# Altium project analog_osc.PrjPCB
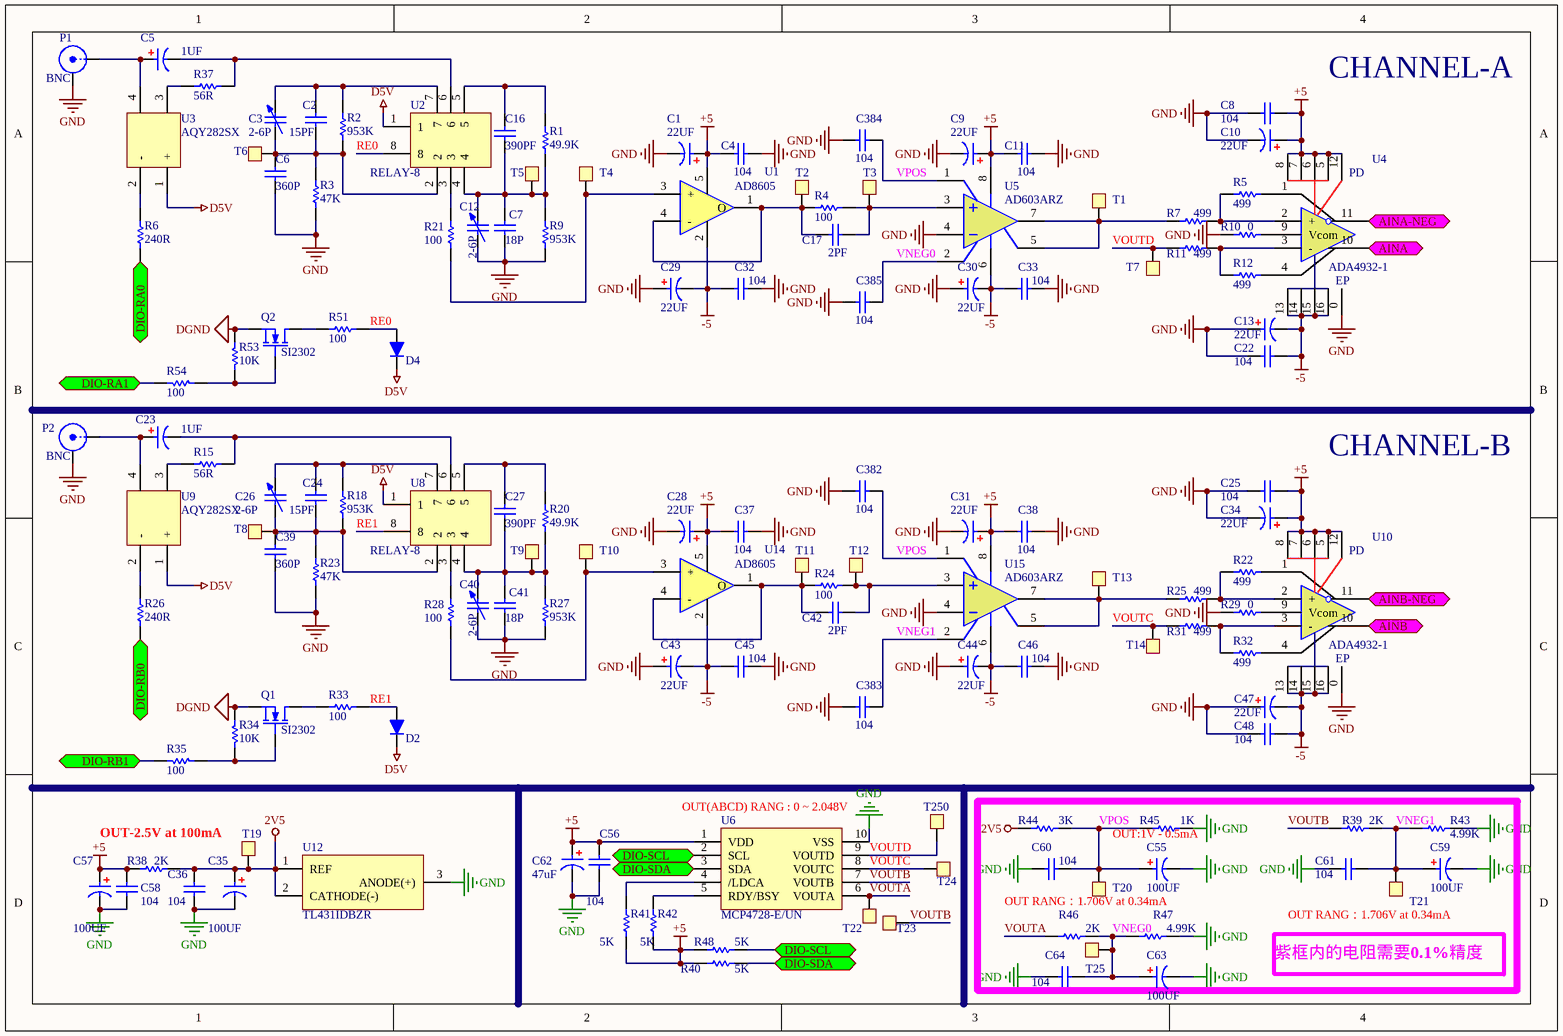
[diagram p0: analog_osc.SchDoc]
3 sheets, 292 parts. Net scope: flat (ports and power ports of the same name join across sheets).
Board files: analog_osc.PcbDoc, analog_edit.PcbDoc
Sheets:
  analog_osc.SchDoc
  digtal.SchDoc
  adc.SchDoc

## Sheet analog_osc.SchDoc
size A4

### Parts
C1  22UF  [0603C]
C2  15PF  [0603C]
C3  value 2-6P  [V-CAP]  (hidden comment: V_CAP)
C4  C104  [0402]  (value not drawn)
C5  1UF  [1812]
C6  360P  [0603C]
C7  18P  [0603C]
C8  C104  [0402]  (value not drawn)
C9  22UF  [0603C]
C10  22UF  [0603C]
C11  C104  [0402]  (value not drawn)
C12  value 2-6P  [V-CAP]  (hidden comment: V_CAP)
C13  22UF  [0603C]
C16  390PF  [0603C]
C17  2PF  [0603C]
C22  C104  [0402]  (value not drawn)
C23  1UF  [1812]
C24  15PF  [0603C]
C25  C104  [0402]  (value not drawn)
C26  value 2-6P  [V-CAP]  (hidden comment: V_CAP)
C27  390PF  [0603C]
C28  22UF  [0603C]
C29  22UF  [0603C]
C30  22UF  [0603C]
C31  22UF  [0603C]
C32  C104  [0402]  (value not drawn)
C33  C104  [0402]  (value not drawn)
C34  22UF  [0603C]
C35  100UF  [CAP-T-3630]
C36  C0.1uF  [0402]  (value not drawn)
C37  C104  [0402]  (value not drawn)
C38  C104  [0402]  (value not drawn)
C39  360P  [0603C]
C40  value 2-6P  [V-CAP]  (hidden comment: V_CAP)
C41  18P  [0603C]
C42  2PF  [0603C]
C43  22UF  [0603C]
C44  22UF  [0603C]
C45  C104  [0402]  (value not drawn)
C46  C104  [0402]  (value not drawn)
C47  22UF  [0603C]
C48  C104  [0402]  (value not drawn)
C55  100UF  [CAP-T-3630]
C56  C0.1uF  [0402]  (value not drawn)
C57  100UF  [CAP-T-3630]
C58  C0.1uF  [0402]  (value not drawn)
C59  100UF  [CAP-T-3630]
C60  C0.1uF  [0402]  (value not drawn)
C61  C0.1uF  [0402]  (value not drawn)
C62  47uF  [1206]
C63  100UF  [CAP-T-3630]
C64  C0.1uF  [0402]  (value not drawn)
C382  C104  [0402]  (value not drawn)
C383  C104  [0402]  (value not drawn)
C384  C104  [0402]  (value not drawn)
C385  C104  [0402]  (value not drawn)
D2  BAT54WS  [LC-SOD-323F]  (value not drawn)
D4  BAT54WS  [LC-SOD-323F]  (value not drawn)
P1  BNC  [BNC-OSC]
P2  BNC  [BNC-OSC]
Q1  SI2302  [SOT-23-3]
Q2  SI2302  [SOT-23-3]
R1  49.9K  [0603R]
R2  953K  [0603R]
R3  47K  [0603R]
R4  100  [0603R]
R5  499  [0402]
R6  240R  [0603R]
R7  499  [0402]
R9  953K  [0603R]
R10  0  [0603R]
R11  499  [0402]
R12  499  [0402]
R15  56R  [0603R]
R18  953K  [0603R]
R20  49.9K  [0603R]
R21  R100R  [0603R]  (value not drawn)
R22  499  [0402]
R23  47K  [0603R]
R24  100  [0603R]
R25  499  [0402]
R26  240R  [0603R]
R27  953K  [0603R]
R28  R100R  [0603R]  (value not drawn)
R29  0  [0603R]
R31  499  [0402]
R32  499  [0402]
R33  R100R  [0402]  (value not drawn)
R34  R10K  [0402]  (value not drawn)
R35  R100R  [0402]  (value not drawn)
R37  56R  [0603R]
R38  R2K  [0402]  (value not drawn)
R39  R2K  [0402]  (value not drawn)
R40  R5K  [0402]  (value not drawn)
R41  R5K  [0402]  (value not drawn)
R42  R5K  [0402]  (value not drawn)
R43  R4.99K  [0402]  (value not drawn)
R44  R3K  [0402]  (value not drawn)
R45  R1K  [0402]  (value not drawn)
R46  R2K  [0402]  (value not drawn)
R47  R4.99K  [0402]  (value not drawn)
R48  R5K  [0402]  (value not drawn)
R51  R100R  [0402]  (value not drawn)
R53  R10K  [0402]  (value not drawn)
R54  R100R  [0402]  (value not drawn)
T1  TP  [TEST_POINT]  (value not drawn)
T2  TP  [TEST_POINT]  (value not drawn)
T3  TP  [TEST_POINT]  (value not drawn)
T4  TP  [TEST_POINT]  (value not drawn)
T5  TP  [TEST_POINT]  (value not drawn)
T6  TP  [TEST_POINT]  (value not drawn)
T7  TP  [TEST_POINT]  (value not drawn)
T8  TP  [TEST_POINT]  (value not drawn)
T9  TP  [TEST_POINT]  (value not drawn)
T10  TP  [TEST_POINT]  (value not drawn)
T11  TP  [TEST_POINT]  (value not drawn)
T12  TP  [TEST_POINT]  (value not drawn)
T13  TP  [TEST_POINT]  (value not drawn)
T14  TP  [TEST_POINT]  (value not drawn)
T19  TP  [TEST_POINT]  (value not drawn)
T20  TP  [TEST_POINT]  (value not drawn)
T21  TP  [TEST_POINT]  (value not drawn)
T22  TP  [TEST_POINT]  (value not drawn)
T23  TP  [TEST_POINT]  (value not drawn)
T24  TP  [TEST_POINT]  (value not drawn)
T25  TP  [TEST_POINT]  (value not drawn)
T250  TP  [TEST_POINT]  (value not drawn)
U1  AD8605  [SOT23-5]
U2  RELAY-8  [RELAY-GS6-8]
U3  AQY282SX  [SOP4]
U4  ADA4932-1  [LFCSP-16]
U5  AD603ARZ  [SOP-8]
U6  MCP4728-E/UN  [MSOP10]
U8  RELAY-8  [RELAY-GS6-8]
U9  AQY282SX  [SOP4]
U10  ADA4932-1  [LFCSP-16]
U12  TL431IDBZR  [SOT-23-3]
U14  AD8605  [SOT23-5]
U15  AD603ARZ  [SOP-8]

### Blocks framed on the sheet
紫框内的电阻需要0.1%精度: C55 C59-C61 C63 C64 R39 R43-R47 T20 T21 T25

### Ports
AINA, AINA-NEG, AINB, AINB-NEG, DIO-RA0, DIO-RA1, DIO-RB0, DIO-RB1, DIO-SCL, DIO-SDA

### Nets
2V5: C35.1 C36.1 R38.2 R44.2 T19.1(R) U12.1(REF) U12.2(CATHODE(-))
+5: C1.1 C4.1 C8.2 C9.1 C10.1 C11.1 C25.2 C28.1 C31.1 C34.1 C37.1 C38.1 C56.1 C57.1 C58.1 C62.1 R38.1 R40.1 R41.1 R42.1 R48.2 U1.5(V+) U4.5 U4.6 U4.7 U4.8 U4.12(PD) U5.8(V+) U6.1(VDD) U10.5 U10.6 U10.7 U10.8 U10.12(PD) U14.5(V+) U15.8(V+)
-5: C13.2 C22.2 C29.2 C30.2 C32.1 C33.1 C43.2 C44.2 C45.1 C46.1 C47.2 C48.2 U1.2(V-) U4.13 U4.14 U4.15 U4.16 U5.6(V-) U10.13 U10.14 U10.15 U10.16 U14.2(V-) U15.6(V-)
D5V: D2.2(K) D4.2(K) U2.1 U3.1(+) U8.1 U9.1(+)
DGND: C1.2 C4.2 C6.2 C7.2 C8.1 C9.2 C10.2 C11.2 C12.1 C13.1 C22.1 C25.1 C28.2 C29.1 C30.1 C31.2 C32.2 C33.2 C34.2 C35.2 C36.2 C37.2 C38.2 C39.2 C40.1 C41.2 C43.1 C44.1 C45.2 C46.2 C47.1 C48.1 C55.2 C56.2 C57.2 C58.2 C59.2 C60.1 C61.1 C62.2 C63.2 C64.1 C382.1 C383.1 C384.1 C385.1 P1.2(Y) P2.2(Y) Q1.2(S) Q2.2(S) R3.2 R9.2 R10.1 R23.2 R27.2 R29.1 R34.2 R43.1 R45.1 R47.1 R53.2 U4.0(EP) U5.4(IN-) U6.10(VSS) U10.0(EP) U12.3(ANODE(+)) U15.4(IN-)  [also labelled GND]
RE0: D4.1(A) R51.2 U2.8
RE1: D2.1(A) R33.2 U8.8
VNEG0: C63.1 C64.2 C385.2 R46.1 R47.2 T25.1(R) U5.2(G-)
VNEG1: C59.1 C61.2 C383.2 R39.1 R43.2 T21.1(R) U15.2(G-)
VOUTA: R46.2 T22.1(R) U6.6(VOUTA)
VOUTB: R39.2 T23.1(R) U6.7(VOUTB)
VOUTC: R31.1 T14.1(R) T24.1(R) U6.8(VOUTC)
VOUTD: R11.1 T7.1(R) T250.1(R) U6.9(VOUTD)
VPOS: C55.1 C60.2 C382.2 C384.2 R44.1 R45.2 T20.1(R) U5.1(G+) U15.1(G+)
NetC2_1: C2.1 C3.2 R2.1 U2.7
NetC2_2: C2.2 C3.1 C6.1 R2.2 R3.1 T6.1(R) U2.2
NetC5_1: C5.1 P1.1(X) U3.4
NetC5_2: C5.2 R37.2 U2.6
NetC7_1: C7.1 C12.2 C16.2 R1.2 R9.1 T5.1(R) U2.4
NetC16_1: C16.1 R1.1 U2.5
NetC17_1: C17.1 R4.1 T2.1(R) U1.1(O) U1.4(-)
NetC17_2: C17.2 R4.2 T3.1(R) U5.3(IN+)
NetC23_1: C23.1 P2.1(X) U9.4
NetC23_2: C23.2 R15.2 U8.6
NetC24_1: C24.1 C26.2 R18.1 U8.7
NetC24_2: C24.2 C26.1 C39.1 R18.2 R23.1 T8.1(R) U8.2
NetC27_1: C27.1 R20.1 U8.5
NetC27_2: C27.2 C40.2 C41.1 R20.2 R27.1 T9.1(R) U8.4
NetC42_1: C42.1 R24.1 T11.1(R) U14.1(O) U14.4(-)
NetC42_2: C42.2 R24.2 T12.1(R) U15.3(IN+)
NetP3_20: R35.2 ; port DIO-RB1
NetP3_21: R26.1 ; port DIO-RB0
NetP3_25: R40.2 U6.3(SDA) ; port DIO-SDA
NetP3_26: R48.1 U6.2(SCL) ; port DIO-SCL
NetP3_38: R6.1 ; port DIO-RA0
NetP3_39: R54.2 ; port DIO-RA1
NetQ1_1: Q1.1(G) R34.1 R35.1
NetQ1_3: Q1.3(D) R33.1
NetQ2_1: Q2.1(G) R53.1 R54.1
NetQ2_3: Q2.3(D) R51.1
NetR5_1: R5.1 R7.2 U4.2(+)
NetR5_2: R5.2 U4.1
NetR6_2: R6.2 U3.2(-)
NetR7_1: R7.1 T1.1(R) U5.5(FB) U5.7(OUT)
NetR10_2: R10.2 U4.9(Vcom)
NetR11_2: R11.2 R12.1 U4.3(-)
NetR12_2: R12.2 U4.4
NetR15_1: R15.1 U9.3
NetR21_1: R21.1 U2.3
NetR21_2: R21.2 T4.1(R) U1.3(+)
NetR22_1: R22.1 R25.2 U10.2(+)
NetR22_2: R22.2 U10.1
NetR25_1: R25.1 T13.1(R) U15.5(FB) U15.7(OUT)
NetR26_2: R26.2 U9.2(-)
NetR28_1: R28.1 U8.3
NetR28_2: R28.2 T10.1(R) U14.3(+)
NetR29_2: R29.2 U10.9(Vcom)
NetR31_2: R31.2 R32.1 U10.3(-)
NetR32_2: R32.2 U10.4
NetR37_1: R37.1 U3.3
NetR41_2: R41.2 U6.4(/LDCA)
NetR42_2: R42.2 U6.5(RDY/BSY)
NetR52_1: U10.10 ; port AINB
NetR60_1: U4.11 ; port AINA-NEG
NetR69_2: U4.10 ; port AINA
NetR72_2: U10.11 ; port AINB-NEG

### Notes on the sheet
- CHANNEL-A
- CHANNEL-B
- OUT-2.5V at 100mA
- (near U6) OUT(ABCD) RANG : 0 ~ 2.048V
- (near R45) OUT:1V - 0.5mA
- (near T20) OUT RANG：1.706V at 0.34mA
- OUT RANG：1.706V at 0.34mA
- (in symbol C0.1uF) 104
- (in symbol R10K) 2K; 5K; 3K; 1K; 4.99K; 10K
- (in symbol R100R) 100

### Library data of the parts
C1 C5 C9 C10 C13 C23 C28-C31 C34 C35 C43 C44 C47 C55 C57 C59 C62 C63 = C10uF: 贴片电容
C2 C4 C6-C8 C11 C16 C17 C22 C24 C25 C27 C32 C33 C37-C39 C41 C42 C45 C46 C48 C382-C385 = C0.1uF: 贴片电容
C3 C12 C26 C40 = Cap Var: Variable or Adjustable Capacitor; Published: 24-Mar-1999; LatestRevisionDate: 29-May-2009; LatestRevisionNote: IPC-7351 Footprint Added.; PackageReference: C1210; Publisher: Altium Limited; PackageDescription: Chip Capacitor 1210 Case Size; Code_JEITA: 1210; Code_IPC: CAPC3225
D2 D4 = Diode
P1 P2 = BNC: BNC Elbow Connector; LatestRevisionDate: 17-Jul-2002; LatestRevisionNote: Re-released for DXP Platform.; Publisher: Altium Limited
Q1 Q2 = MOSFET-N
R1-R7 R9-R12 R15 R18 R20 R22-R27 R29 R31 R32 R37 = R1M
R38-R48 = R10K

## Sheet digtal.SchDoc
size A4
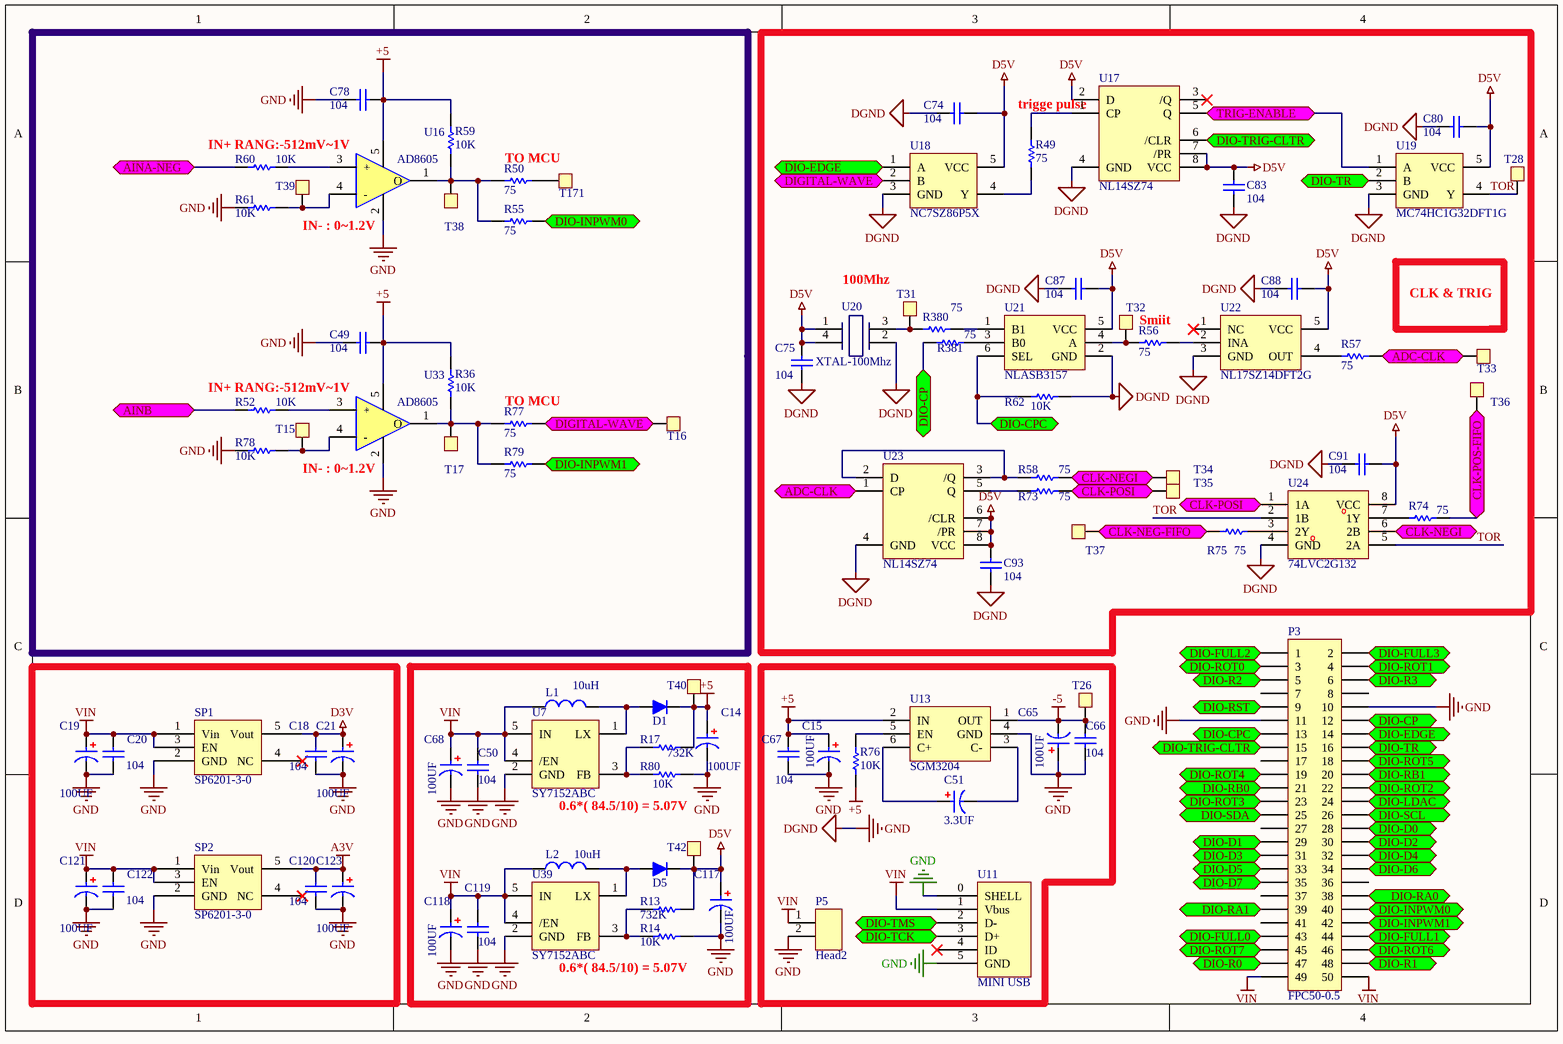
[diagram p1: digtal.SchDoc]

### Parts
C14  100UF  [CAP-T-3630]
C15  100UF  [CAP-T-3630]
C18  C104  [0402]  (value not drawn)
C19  100UF  [CAP-T-3630]
C20  C104  [0402]  (value not drawn)
C21  100UF  [CAP-T-3630]
C49  C104  [0402]  (value not drawn)
C50  C104  [0402]  (value not drawn)
C51  3.3UF  [0603C]
C65  100UF  [CAP-T-3630]
C66  C104  [0402]  (value not drawn)
C67  C104  [0402]  (value not drawn)
C68  100UF  [CAP-T-3630]
C74  C104  [0402]  (value not drawn)
C75  C104  [0402]  (value not drawn)
C78  C104  [0402]  (value not drawn)
C80  C104  [0402]  (value not drawn)
C83  C104  [0402]  (value not drawn)
C87  C104  [0402]  (value not drawn)
C88  C104  [0402]  (value not drawn)
C91  C104  [0402]  (value not drawn)
C93  C104  [0402]  (value not drawn)
C117  100UF  [CAP-T-3630]
C118  100UF  [CAP-T-3630]
C119  C104  [0402]  (value not drawn)
C120  C104  [0402]  (value not drawn)
C121  100UF  [CAP-T-3630]
C122  C104  [0402]  (value not drawn)
C123  100UF  [CAP-T-3630]
D1  1N5918WS  [SOD23-322F]  (value not drawn)
D5  1N5918WS  [SOD23-322F]  (value not drawn)
L1  10uH  [0805]
L2  10uH  [0805]
P3  FPC50-0.5  [FPC50-0.5]
P5  Head2  [HEAD2]
R13  732K  [0402]
R14  10K  [0402]
R17  732K  [0402]
R36  10K  [0402]
R49  75  [0402]
R50  75  [0402]
R52  10K  [0402]
R55  75  [0402]
R56  75  [0402]
R57  75  [0402]
R58  75  [0402]
R59  10K  [0402]
R60  10K  [0402]
R61  10K  [0402]
R62  10K  [0402]
R73  75  [0402]
R74  75  [0402]
R75  75  [0402]
R76  R10K  [0402]  (value not drawn)
R77  75  [0402]
R78  10K  [0402]
R79  75  [0402]
R80  10K  [0402]
R380  75  [0402]
R381  75  [0402]
SP1  SP6201-3-0  [SOT23-5]
SP2  SP6201-3-0  [SOT23-5]
T15  TP  [TEST_POINT]  (value not drawn)
T16  TP  [TEST_POINT]  (value not drawn)
T17  TP  [TEST_POINT]  (value not drawn)
T26  TP  [TEST_POINT]  (value not drawn)
T28  TP  [TEST_POINT]  (value not drawn)
T31  TP  [TEST_POINT]  (value not drawn)
T32  TP  [TEST_POINT]  (value not drawn)
T33  TP  [TEST_POINT]  (value not drawn)
T34  TP  [TEST_POINT]  (value not drawn)
T35  TP  [TEST_POINT]  (value not drawn)
T36  TP  [TEST_POINT]  (value not drawn)
T37  TP  [TEST_POINT]  (value not drawn)
T38  TP  [TEST_POINT]  (value not drawn)
T39  TP  [TEST_POINT]  (value not drawn)
T40  TP  [TEST_POINT]  (value not drawn)
T42  TP  [TEST_POINT]  (value not drawn)
T171  TP  [TEST_POINT]  (value not drawn)
U7  SY7152ABC  [SOT23-6]
U11  MINI USB  [Micro_USB_t]
U13  SGM3204  [SOT23-6]
U16  AD8605  [SOT23-5]
U17  NL14SZ74  [VFSOP-8]
U18  NC7SZ86P5X  [sc70-5]
U19  MC74HC1G32DFT1G  [SC70-5]
U20  XTAL-100Mhz  [7050]
U21  NLASB3157  [SC-88]
U22  NL17SZ14DFT2G  [SC70-5]
U23  NL14SZ74  [VFSOP-8]
U24  74LVC2G132  [VFSOP-8]
U33  AD8605  [SOT23-5]
U39  SY7152ABC  [SOT23-6]

### Ports
ADC-CLK, AINA-NEG, AINB, CLK-NEG-FIFO, CLK-NEGI, CLK-POS-FIFO, CLK-POSI, DIGITAL-WAVE, DIO-CP, DIO-CPC, DIO-D0, DIO-D1, DIO-D2, DIO-D3, DIO-D4, DIO-D5, DIO-D6, DIO-D7, DIO-EDGE, DIO-FULL0, DIO-FULL1, DIO-FULL2, DIO-FULL3, DIO-INPWM0, DIO-INPWM1, DIO-LDAC, DIO-R0, DIO-R1, DIO-R2, DIO-R3, DIO-RA0, DIO-RA1, DIO-RB0, DIO-RB1, DIO-ROT0, DIO-ROT1, DIO-ROT2, DIO-ROT3, DIO-ROT4, DIO-ROT5, DIO-ROT6, DIO-ROT7, DIO-RST, DIO-SCL, DIO-SDA, DIO-TCK, DIO-TMS, DIO-TR, DIO-TRIG-CLTR, TRIG-ENABLE

### Nets
+5: C14.1 C15.1 C49.1 C67.1 C78.1 D1.2(K) R17.2 R36.1 R59.1 R76.1 T40.1(R) U13.2(IN) U16.5(V+) U33.5(V+)
-5: C65.2 C66.1 T26.1(R) U13.1(OUT)
A3V: C120.1 C123.1 SP2.5(Vout)
D3V: C18.1 C21.1 SP1.5(Vout)
D5V: C74.1 C75.1 C80.1 C83.1 C87.1 C88.1 C91.1 C93.1 C117.1 D5.2(K) R13.2 T42.1(R) U17.2(D) U17.7(/PR) U17.8(VCC) U18.5(VCC) U19.5(VCC) U20.1 U20.4 U21.5(VCC) U22.5(VCC) U23.6(/CLR) U23.7(/PR) U23.8(VCC) U24.8(VCC)
DGND: C14.2 C15.2 C18.2 C19.2 C20.2 C21.2 C49.2 C50.2 C65.1 C66.2 C67.2 C68.2 C74.2 C75.2 C78.2 C80.2 C83.2 C87.2 C88.2 C91.2 C93.2 C117.2 C118.2 C119.2 C120.2 C121.2 C122.2 C123.2 P3.10 P3.11 P5.2 R14.1 R61.1 R62.2 R78.1 R80.1 SP1.2(GND) SP2.2(GND) U7.2(GND) U11.0(SHELL) U11.5(GND) U13.4(GND) U16.2(V-) U17.4(GND) U18.3(GND) U19.3(GND) U20.2 U21.2(GND) U22.3(GND) U23.4(GND) U24.4(GND) U33.2(V-) U39.2(GND)  [also labelled GND]
VIN: C19.1 C20.1 C50.1 C68.1 C118.1 C119.1 C121.1 C122.1 L1.1 L2.1 P3.49 P3.50 P5.1 SP1.1(Vin) SP1.3(EN) SP2.1(Vin) SP2.3(EN) U7.4(/EN) U7.5(IN) U11.1(Vbus) U39.4(/EN) U39.5(IN)
DQA1: P3.28 ; port DIO-D0
DQA2: P3.29 ; port DIO-D1
DQA3: P3.30 ; port DIO-D2
DQA4: P3.31 ; port DIO-D3
DQA5: P3.35 ; port DIO-D7
DQA6: P3.34 ; port DIO-D6
DQA7: P3.33 ; port DIO-D5
DQA8: P3.32 ; port DIO-D4
TOR: T28.1(R) U19.4(Y) U24.2(1B) U24.5(2A)
NetC51_1: C51.1 U13.6(C+)
NetC51_2: C51.2 U13.3(C-)
NetD1_1: D1.1(A) L1.2 U7.1(LX)
NetD5_1: D5.1(A) L2.2 U39.1(LX)
NetP3_1: P3.1 ; port DIO-FULL2
NetP3_2: P3.2 ; port DIO-FULL3
NetP3_3: P3.3 ; port DIO-ROT0
NetP3_4: P3.4 ; port DIO-ROT1
NetP3_5: P3.5 ; port DIO-R2
NetP3_6: P3.6 ; port DIO-R3
NetP3_9: P3.9 ; port DIO-RST
NetP3_12: P3.12 R381.2 ; port DIO-CP
NetP3_13: P3.13 R62.1 U21.6(SEL) ; port DIO-CPC
NetP3_14: P3.14 U18.1(A) ; port DIO-EDGE
NetP3_15: P3.15 U17.6(/CLR) ; port DIO-TRIG-CLTR
NetP3_16: P3.16 U19.2(B) ; port DIO-TR
NetP3_18: P3.18 ; port DIO-ROT5
NetP3_19: P3.19 ; port DIO-ROT4
NetP3_20: P3.20 ; port DIO-RB1
NetP3_21: P3.21 ; port DIO-RB0
NetP3_22: P3.22 ; port DIO-ROT2
NetP3_23: P3.23 ; port DIO-ROT3
NetP3_24: P3.24 ; port DIO-LDAC
NetP3_25: P3.25 ; port DIO-SDA
NetP3_26: P3.26 ; port DIO-SCL
NetP3_38: P3.38 ; port DIO-RA0
NetP3_39: P3.39 ; port DIO-RA1
NetP3_40: P3.40 R55.2 ; port DIO-INPWM0
NetP3_42: P3.42 R79.2 ; port DIO-INPWM1
NetP3_43: P3.43 ; port DIO-FULL0
NetP3_44: P3.44 ; port DIO-FULL1
NetP3_45: P3.45 ; port DIO-ROT7
NetP3_46: P3.46 ; port DIO-ROT6
NetP3_47: P3.47 ; port DIO-R0
NetP3_48: P3.48 ; port DIO-R1
NetR13_1: R13.1 R14.2 U39.3(FB)
NetR17_1: R17.1 R80.2 U7.3(FB)
NetR36_2: R36.2 R77.1 R79.1 T17.1(R) U33.1(O)
NetR49_1: R49.1 U18.4(Y)
NetR49_2: R49.2 U17.1(CP)
NetR50_1: R50.1 R55.1 R59.2 T38.1(R) U16.1(O)
NetR50_2: R50.2 T171.1(R)
NetR52_1: R52.1 ; port AINB
NetR52_2: R52.2 U33.3(+)
NetR56_1: R56.1 U22.2(INA)
NetR56_2: R56.2 T32.1(R) U21.4(A)
NetR57_1: R57.1 T33.1(R) U23.1(CP) ; port ADC-CLK
NetR57_2: R57.2 U22.4(OUT)
NetR58_1: R58.1 T34.1(R) U24.6(2B) ; port CLK-NEGI
NetR58_2: R58.2 U23.2(D) U23.3(/Q)
NetR60_1: R60.1 ; port AINA-NEG
NetR60_2: R60.2 U16.3(+)
NetR61_2: R61.2 T39.1(R) U16.4(-)
NetR73_1: R73.1 T35.1(R) U24.1(1A) ; port CLK-POSI
NetR73_2: R73.2 U23.5(Q)
NetR74_1: R74.1 T36.1(R) ; port CLK-POS-FIFO
NetR74_2: R74.2 U24.7(1Y)
NetR75_1: R75.1 U24.3(2Y)
NetR75_2: R75.2 T37.1(R) ; port CLK-NEG-FIFO
NetR76_2: R76.2 U13.5(EN)
NetR77_2: R77.2 T16.1(R) U18.2(B) ; port DIGITAL-WAVE
NetR78_2: R78.2 T15.1(R) U33.4(-)
NetR380_1: R380.1 U21.1(B1)
NetR380_2: R380.2 T31.1(R) U20.3
NetR381_1: R381.1 U21.3(B0)
NetU11_2: U11.2(D-) ; port DIO-TMS
NetU11_3: U11.3(D+) ; port DIO-TCK
NetU17_5: U17.5(Q) U19.1(A) ; port TRIG-ENABLE

Not connected (* = marked no-connect by the designer): P3 7 8 17 27 36 37 41; SP1 4(NC)*; SP2 4(NC)*; U7 6; U11 4(ID)*; U17 3(/Q)*; U22 1(NC)*; U39 6

### Notes on the sheet
- (near U17) trigge pulse
- (near R60) IN+ RANG:-512mV~1V
- TO MCU
- IN- : 0~1.2V
- 100Mhz
- CLK & TRIG
- Smiit
- (near R52) IN+ RANG:-512mV~1V
- (near R77) TO MCU
- 0.6*( 84.5/10) = 5.07V
- (in symbol C0.1uF) 104
- (in symbol R10K) 10K

### Library data of the parts
C14 C15 C19 C21 C51 C65 C68 C117 C118 C121 C123 = C10uF: 贴片电容
C18 C20 C49 C50 C66 C67 C74 C75 C78 C80 C83 C87 C88 C91 C93 C119 C120 C122 = C0.1uF: 贴片电容
D1 D5 = Diode
L1 L2 = Inductor-100uH
P3 = Header 25X2: Header, 25-Pin, Dual row; LatestRevisionDate: 17-Jul-2002; LatestRevisionNote: Re-released for DXP Platform.; Publisher: Altium Limited
R13 R14 R17 R36 R49 R50 R52 R55-R62 R73-R75 R77-R80 R380 R381 = R1M
SP1 SP2 = SP6201
U24 = 74LVC2G132DCUR

## Sheet adc.SchDoc
size A4
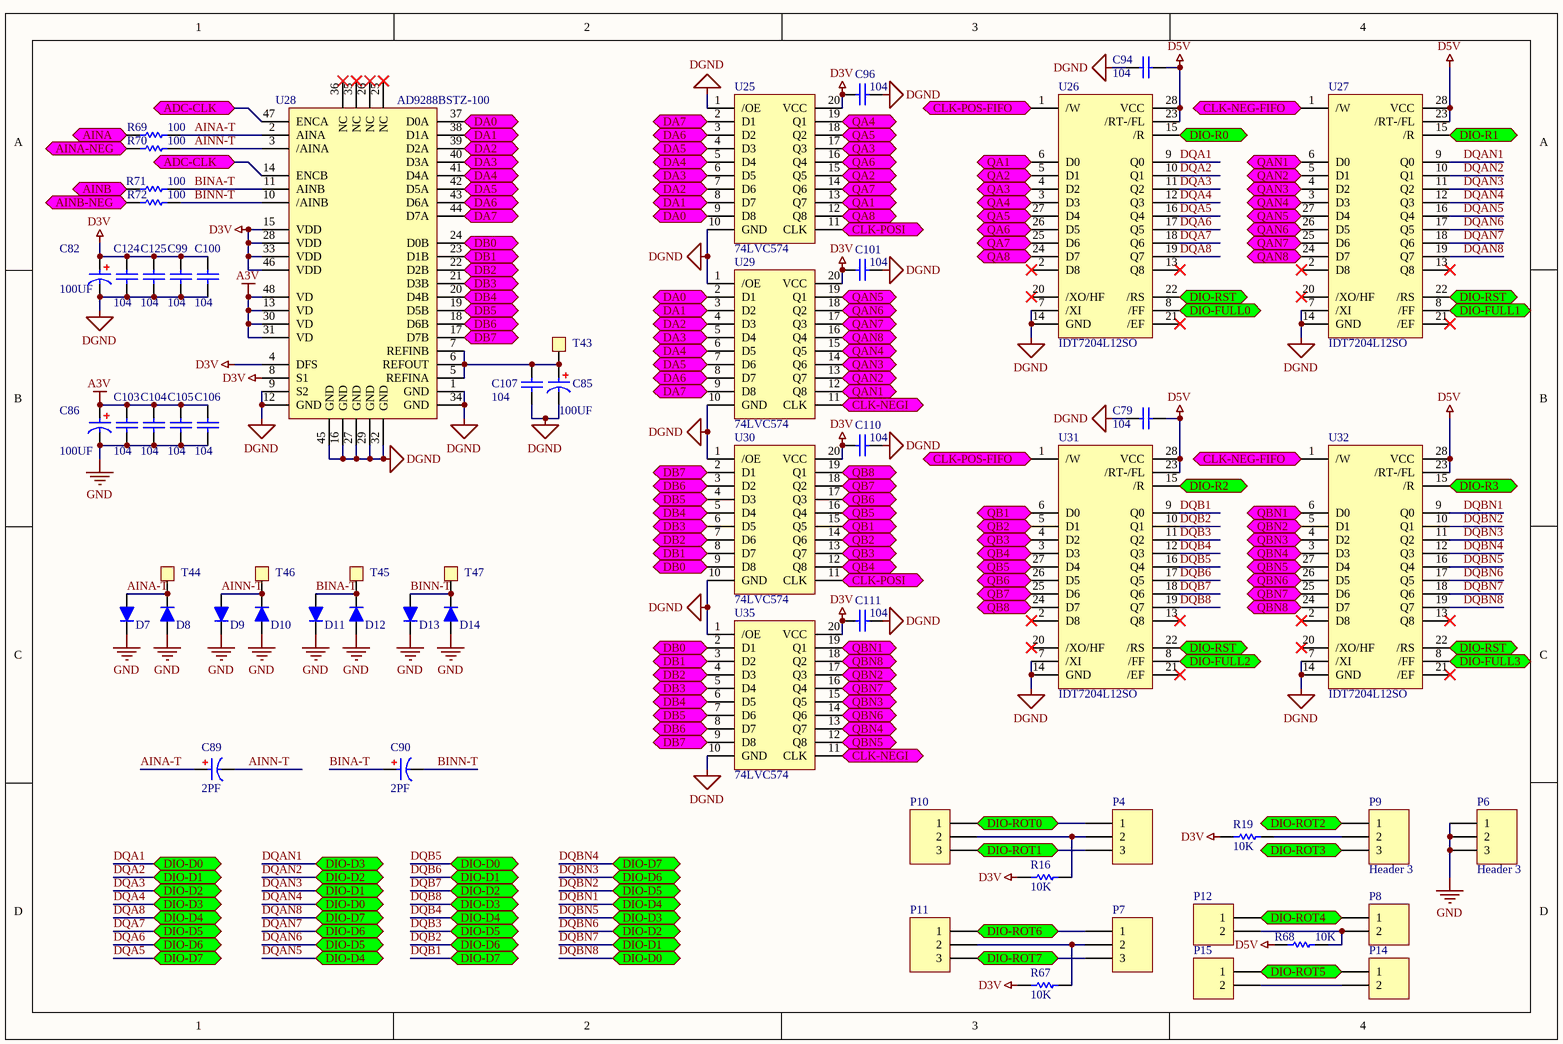
[diagram p2: adc.SchDoc]

### Parts
C79  C104  [0402]  (value not drawn)
C82  100UF  [CAP-T-3630]
C85  100UF  [CAP-T-3630]
C86  100UF  [CAP-T-3630]
C89  2PF  [0603C]
C90  2PF  [0603C]
C94  C104  [0402]  (value not drawn)
C96  C104  [0402]  (value not drawn)
C99  C104  [0402]  (value not drawn)
C100  C104  [0402]  (value not drawn)
C101  C104  [0402]  (value not drawn)
C103  C104  [0402]  (value not drawn)
C104  C104  [0402]  (value not drawn)
C105  C104  [0402]  (value not drawn)
C106  C104  [0402]  (value not drawn)
C107  C104  [0402]  (value not drawn)
C110  C104  [0402]  (value not drawn)
C111  C104  [0402]  (value not drawn)
C124  C104  [0402]  (value not drawn)
C125  C104  [0402]  (value not drawn)
D7  KDS4148U  [LC-SOD-323F]  (value not drawn)
D8  KDS4148U  [LC-SOD-323F]  (value not drawn)
D9  KDS4148U  [LC-SOD-323F]  (value not drawn)
D10  KDS4148U  [LC-SOD-323F]  (value not drawn)
D11  KDS4148U  [LC-SOD-323F]  (value not drawn)
D12  KDS4148U  [LC-SOD-323F]  (value not drawn)
D13  KDS4148U  [LC-SOD-323F]  (value not drawn)
D14  KDS4148U  [LC-SOD-323F]  (value not drawn)
P4  Header 3  [ROTA-3PIN]  (value not drawn)
P6  Header 3  [ROTA-3PIN]
P7  Header 3  [ROTA-3PIN]  (value not drawn)
P8  Header 2  [ROTA-2PIN]  (value not drawn)
P9  Header 3  [ROTA-3PIN]
P10  Header 3  [ROTA-3PIN]  (value not drawn)
P11  Header 3  [ROTA-3PIN]  (value not drawn)
P12  Header 2  [ROTA-2PIN]  (value not drawn)
P14  Header 2  [ROTA-2PIN]  (value not drawn)
P15  Header 2  [ROTA-2PIN]  (value not drawn)
R16  10K  [0402]
R19  10K  [0402]
R67  10K  [0402]
R68  10K  [0402]
R69  100  [0603R]
R70  100  [0603R]
R71  100  [0603R]
R72  100  [0603R]
T43  TP  [TEST_POINT]  (value not drawn)
T44  TP  [TEST_POINT]  (value not drawn)
T45  TP  [TEST_POINT]  (value not drawn)
T46  TP  [TEST_POINT]  (value not drawn)
T47  TP  [TEST_POINT]  (value not drawn)
U25  74LVC574  [TSSOP20]
U26  IDT7204L12SO  [SO28-3]
U27  IDT7204L12SO  [SO28-3]
U28  AD9288BSTZ-100  [LQFP48]
U29  74LVC574  [TSSOP20]
U30  74LVC574  [TSSOP20]
U31  IDT7204L12SO  [SO28-3]
U32  IDT7204L12SO  [SO28-3]
U35  74LVC574  [TSSOP20]

### Ports
ADC-CLK, AINA, AINA-NEG, AINB, AINB-NEG, CLK-NEG-FIFO, CLK-NEGI, CLK-POS-FIFO, CLK-POSI, DA0, DA1, DA2, DA3, DA4, DA5, DA6, DA7, DB0, DB1, DB2, DB3, DB4, DB5, DB6, DB7, DIO-D0, DIO-D1, DIO-D2, DIO-D3, DIO-D4, DIO-D5, DIO-D6, DIO-D7, DIO-FULL0, DIO-FULL1, DIO-FULL2, DIO-FULL3, DIO-R0, DIO-R1, DIO-R2, DIO-R3, DIO-ROT0, DIO-ROT1, DIO-ROT2, DIO-ROT3, DIO-ROT4, DIO-ROT5, DIO-ROT6, DIO-ROT7, DIO-RST, QA1, QA2, QA3, QA4, QA5, QA6, QA7, QA8, QAN1, QAN2, QAN3, QAN4, QAN5, QAN6, QAN7, QAN8, QB1, QB2, QB3, QB4, QB5, QB6, QB7, QB8, QBN1, QBN2, QBN3, QBN4, QBN5, QBN6, QBN7, QBN8

### Nets
A3V: C86.1 C103.1 C104.1 C105.1 C106.1 U28.13(VD) U28.30(VD) U28.31(VD) U28.48(VD)
D3V: C82.1 C96.1 C99.1 C100.1 C101.1 C110.1 C111.1 C124.1 C125.1 R16.1 R19.1 R67.1 U25.20(VCC) U28.4(DFS) U28.8(S1) U28.15(VDD) U28.28(VDD) U28.33(VDD) U28.46(VDD) U29.20(VCC) U30.20(VCC) U35.20(VCC)
D5V: C79.1 C94.1 R68.1 U26.23(/RT-/FL) U26.28(VCC) U27.23(/RT-/FL) U27.28(VCC) U31.23(/RT-/FL) U31.28(VCC) U32.23(/RT-/FL) U32.28(VCC)
DGND: C79.2 C82.2 C85.2 C86.2 C94.2 C96.2 C99.2 C100.2 C101.2 C103.2 C104.2 C105.2 C106.2 C107.2 C110.2 C111.2 C124.2 C125.2 D7.2(K) D8.1(A) D9.2(K) D10.1(A) D11.2(K) D12.1(A) D13.2(K) D14.1(A) P6.1 P6.2 P6.3 U25.1(/OE) U25.10(GND) U26.7(/XI) U26.14(GND) U27.7(/XI) U27.14(GND) U28.1(GND) U28.9(S2) U28.12(GND) U28.16(GND) U28.27(GND) U28.29(GND) U28.32(GND) U28.34(GND) U28.45(GND) U29.1(/OE) U29.10(GND) U30.1(/OE) U30.10(GND) U31.7(/XI) U31.14(GND) U32.7(/XI) U32.14(GND) U35.1(/OE) U35.10(GND)  [also labelled GND]
AINA-T: C89.1 D7.1(A) D8.2(K) R69.1 T44.1(R) U28.2(AINA)
AINN-T: C89.2 D9.1(A) D10.2(K) R70.1 T46.1(R) U28.3(/AINA)
BINA-T: C90.1 D11.1(A) D12.2(K) R71.1 T45.1(R) U28.11(AINB)
BINN-T: C90.2 D13.1(A) D14.2(K) R72.1 T47.1(R) U28.10(/AINB)
DQA1: U26.9(Q0) U27.12(Q3) U31.16(Q4) U32.19(Q7) ; port DIO-D0  [also labelled DQAN4, DQB5, DQBN8]
DQA2: U26.10(Q1) U27.11(Q2) U31.17(Q5) U32.18(Q6) ; port DIO-D1  [also labelled DQAN3, DQB6, DQBN7]
DQA3: U26.11(Q2) U27.10(Q1) U31.18(Q6) U32.17(Q5) ; port DIO-D2  [also labelled DQAN2, DQB7, DQBN6]
DQA4: U26.12(Q3) U27.9(Q0) U31.19(Q7) U32.16(Q4) ; port DIO-D3  [also labelled DQAN1, DQB8, DQBN5]
DQA5: U26.16(Q4) U27.19(Q7) U31.9(Q0) U32.12(Q3) ; port DIO-D7  [also labelled DQAN8, DQB1, DQBN4]
DQA6: U26.17(Q5) U27.18(Q6) U31.10(Q1) U32.11(Q2) ; port DIO-D6  [also labelled DQAN7, DQB2, DQBN3]
DQA7: U26.18(Q6) U27.17(Q5) U31.11(Q2) U32.10(Q1) ; port DIO-D5  [also labelled DQAN6, DQB3, DQBN2]
DQA8: U26.19(Q7) U27.16(Q4) U31.12(Q3) U32.9(Q0) ; port DIO-D4  [also labelled DQAN5, DQB4, DQBN1]
NetC85_1: C85.1 C107.1 T43.1(R) U28.5(REFINA) U28.6(REFOUT) U28.7(REFINB)
NetP3_1: U31.8(/FF) ; port DIO-FULL2
NetP3_2: U32.8(/FF) ; port DIO-FULL3
NetP3_3: P4.1 P10.1 ; port DIO-ROT0
NetP3_4: P4.3 P10.3 ; port DIO-ROT1
NetP3_5: U31.15(/R) ; port DIO-R2
NetP3_6: U32.15(/R) ; port DIO-R3
NetP3_9: U26.22(/RS) U27.22(/RS) U31.22(/RS) U32.22(/RS) ; port DIO-RST
NetP3_18: P14.1 P15.1 ; port DIO-ROT5
NetP3_19: P8.1 P12.1 ; port DIO-ROT4
NetP3_22: P9.1 ; port DIO-ROT2
NetP3_23: P9.3 ; port DIO-ROT3
NetP3_43: U26.8(/FF) ; port DIO-FULL0
NetP3_44: U27.8(/FF) ; port DIO-FULL1
NetP3_45: P7.3 P11.3 ; port DIO-ROT7
NetP3_46: P7.1 P11.1 ; port DIO-ROT6
NetP3_47: U26.15(/R) ; port DIO-R0
NetP3_48: U27.15(/R) ; port DIO-R1
NetP4_2: P4.2 P10.2 R16.2
NetP7_2: P7.2 P11.2 R67.2
NetP8_2: P8.2 P12.2 R68.2
NetP9_2: P9.2 R19.2
NetP14_2: P14.2 P15.2
NetR52_1: R71.2 ; port AINB
NetR57_1: U28.14(ENCB) U28.47(ENCA) ; port ADC-CLK
NetR58_1: U29.11(CLK) U35.11(CLK) ; port CLK-NEGI
NetR60_1: R70.2 ; port AINA-NEG
NetR69_2: R69.2 ; port AINA
NetR72_2: R72.2 ; port AINB-NEG
NetR73_1: U25.11(CLK) U30.11(CLK) ; port CLK-POSI
NetR74_1: U26.1(/W) U31.1(/W) ; port CLK-POS-FIFO
NetR75_2: U27.1(/W) U32.1(/W) ; port CLK-NEG-FIFO
NetU25_2: U25.2(D1) U28.44(D7A) U29.9(D8) ; port DA7
NetU25_3: U25.3(D2) U28.43(D6A) U29.8(D7) ; port DA6
NetU25_4: U25.4(D3) U28.42(D5A) U29.7(D6) ; port DA5
NetU25_5: U25.5(D4) U28.41(D4A) U29.6(D5) ; port DA4
NetU25_6: U25.6(D5) U28.40(D3A) U29.5(D4) ; port DA3
NetU25_7: U25.7(D6) U28.39(D2A) U29.4(D3) ; port DA2
NetU25_8: U25.8(D7) U28.38(D1A) U29.3(D2) ; port DA1
NetU25_9: U25.9(D8) U28.37(D0A) U29.2(D1) ; port DA0
NetU25_12: U25.12(Q8) U26.24(D7) ; port QA8
NetU25_13: U25.13(Q7) U26.6(D0) ; port QA1
NetU25_14: U25.14(Q6) U26.25(D6) ; port QA7
NetU25_15: U25.15(Q5) U26.5(D1) ; port QA2
NetU25_16: U25.16(Q4) U26.26(D5) ; port QA6
NetU25_17: U25.17(Q3) U26.4(D2) ; port QA3
NetU25_18: U25.18(Q2) U26.27(D4) ; port QA5
NetU25_19: U25.19(Q1) U26.3(D3) ; port QA4
NetU27_3: U27.3(D3) U29.15(Q5) ; port QAN4
NetU27_4: U27.4(D2) U29.14(Q6) ; port QAN3
NetU27_5: U27.5(D1) U29.13(Q7) ; port QAN2
NetU27_6: U27.6(D0) U29.12(Q8) ; port QAN1
NetU27_24: U27.24(D7) U29.16(Q4) ; port QAN8
NetU27_25: U27.25(D6) U29.17(Q3) ; port QAN7
NetU27_26: U27.26(D5) U29.18(Q2) ; port QAN6
NetU27_27: U27.27(D4) U29.19(Q1) ; port QAN5
NetU28_17: U28.17(D7B) U30.2(D1) U35.9(D8) ; port DB7
NetU28_18: U28.18(D6B) U30.3(D2) U35.8(D7) ; port DB6
NetU28_19: U28.19(D5B) U30.4(D3) U35.7(D6) ; port DB5
NetU28_20: U28.20(D4B) U30.5(D4) U35.6(D5) ; port DB4
NetU28_21: U28.21(D3B) U30.6(D5) U35.5(D4) ; port DB3
NetU28_22: U28.22(D2B) U30.7(D6) U35.4(D3) ; port DB2
NetU28_23: U28.23(D1B) U30.8(D7) U35.3(D2) ; port DB1
NetU28_24: U28.24(D0B) U30.9(D8) U35.2(D1) ; port DB0
NetU30_12: U30.12(Q8) U31.3(D3) ; port QB4
NetU30_13: U30.13(Q7) U31.4(D2) ; port QB3
NetU30_14: U30.14(Q6) U31.5(D1) ; port QB2
NetU30_15: U30.15(Q5) U31.6(D0) ; port QB1
NetU30_16: U30.16(Q4) U31.27(D4) ; port QB5
NetU30_17: U30.17(Q3) U31.26(D5) ; port QB6
NetU30_18: U30.18(Q2) U31.25(D6) ; port QB7
NetU30_19: U30.19(Q1) U31.24(D7) ; port QB8
NetU32_3: U32.3(D3) U35.13(Q7) ; port QBN4
NetU32_4: U32.4(D2) U35.15(Q5) ; port QBN3
NetU32_5: U32.5(D1) U35.17(Q3) ; port QBN2
NetU32_6: U32.6(D0) U35.19(Q1) ; port QBN1
NetU32_24: U32.24(D7) U35.18(Q2) ; port QBN8
NetU32_25: U32.25(D6) U35.16(Q4) ; port QBN7
NetU32_26: U32.26(D5) U35.14(Q6) ; port QBN6
NetU32_27: U32.27(D4) U35.12(Q8) ; port QBN5

Not connected (* = marked no-connect by the designer): U26 2(D8)* 13(Q8)* 20(/XO/HF)* 21(/EF)*; U27 2(D8)* 13(Q8)* 20(/XO/HF)* 21(/EF)*; U28 25(NC)* 26(NC)* 35(NC)* 36(NC)*; U31 2(D8)* 13(Q8)* 20(/XO/HF)* 21(/EF)*; U32 2(D8)* 13(Q8)* 20(/XO/HF)* 21(/EF)*

### Notes on the sheet
- (in symbol C0.1uF) 104

### Library data of the parts
C79 C94 C96 C99-C101 C103-C107 C110 C111 C124 C125 = C0.1uF: 贴片电容
C82 C85 C86 C89 C90 = C10uF: 贴片电容
D7-D14 = Diode
P4 P6 P7 P9-P11 = Header 3: Header, 3-Pin; LatestRevisionDate: 17-Jul-2002; LatestRevisionNote: Re-released for DXP Platform.; Publisher: Altium Limited
P8 P12 P14 P15 = Header 2: Header, 2-Pin; LatestRevisionDate: 17-Jul-2002; LatestRevisionNote: Re-released for DXP Platform.; Publisher: Altium Limited
R16 R19 R67-R72 = R1M
U28 = AD9288BST-100

## Nets that join several sheets
+5: analog_osc (36 pins), digtal (14 pins)
-5: analog_osc (24 pins), digtal (C65.2 C66.1 T26.1 U13.1)
A3V: digtal (C120.1 C123.1 SP2.5), adc (9 pins)
D3V: digtal (C18.1 C21.1 SP1.5), adc (22 pins)
D5V: analog_osc (6 pins), digtal (25 pins), adc (11 pins)
DGND: analog_osc (67 pins), digtal (53 pins), adc (54 pins)
DQA1: digtal (P3.28), adc (U26.9 U27.12 U31.16 U32.19)
DQA2: digtal (P3.29), adc (U26.10 U27.11 U31.17 U32.18)
DQA3: digtal (P3.30), adc (U26.11 U27.10 U31.18 U32.17)
DQA4: digtal (P3.31), adc (U26.12 U27.9 U31.19 U32.16)
DQA5: digtal (P3.35), adc (U26.16 U27.19 U31.9 U32.12)
DQA6: digtal (P3.34), adc (U26.17 U27.18 U31.10 U32.11)
DQA7: digtal (P3.33), adc (U26.18 U27.17 U31.11 U32.10)
DQA8: digtal (P3.32), adc (U26.19 U27.16 U31.12 U32.9)
NetP3_1: digtal (P3.1), adc (U31.8)
NetP3_2: digtal (P3.2), adc (U32.8)
NetP3_3: digtal (P3.3), adc (P4.1 P10.1)
NetP3_4: digtal (P3.4), adc (P4.3 P10.3)
NetP3_5: digtal (P3.5), adc (U31.15)
NetP3_6: digtal (P3.6), adc (U32.15)
NetP3_9: digtal (P3.9), adc (U26.22 U27.22 U31.22 U32.22)
NetP3_18: digtal (P3.18), adc (P14.1 P15.1)
NetP3_19: digtal (P3.19), adc (P8.1 P12.1)
NetP3_20: analog_osc (R35.2), digtal (P3.20)
NetP3_21: analog_osc (R26.1), digtal (P3.21)
NetP3_22: digtal (P3.22), adc (P9.1)
NetP3_23: digtal (P3.23), adc (P9.3)
NetP3_25: analog_osc (R40.2 U6.3), digtal (P3.25)
NetP3_26: analog_osc (R48.1 U6.2), digtal (P3.26)
NetP3_38: analog_osc (R6.1), digtal (P3.38)
NetP3_39: analog_osc (R54.2), digtal (P3.39)
NetP3_43: digtal (P3.43), adc (U26.8)
NetP3_44: digtal (P3.44), adc (U27.8)
NetP3_45: digtal (P3.45), adc (P7.3 P11.3)
NetP3_46: digtal (P3.46), adc (P7.1 P11.1)
NetP3_47: digtal (P3.47), adc (U26.15)
NetP3_48: digtal (P3.48), adc (U27.15)
NetR52_1: analog_osc (U10.10), digtal (R52.1), adc (R71.2)
NetR57_1: digtal (R57.1 T33.1 U23.1), adc (U28.14 U28.47)
NetR58_1: digtal (R58.1 T34.1 U24.6), adc (U29.11 U35.11)
NetR60_1: analog_osc (U4.11), digtal (R60.1), adc (R70.2)
NetR69_2: analog_osc (U4.10), adc (R69.2)
NetR72_2: analog_osc (U10.11), adc (R72.2)
NetR73_1: digtal (R73.1 T35.1 U24.1), adc (U25.11 U30.11)
NetR74_1: digtal (R74.1 T36.1), adc (U26.1 U31.1)
NetR75_2: digtal (R75.2 T37.1), adc (U27.1 U32.1)